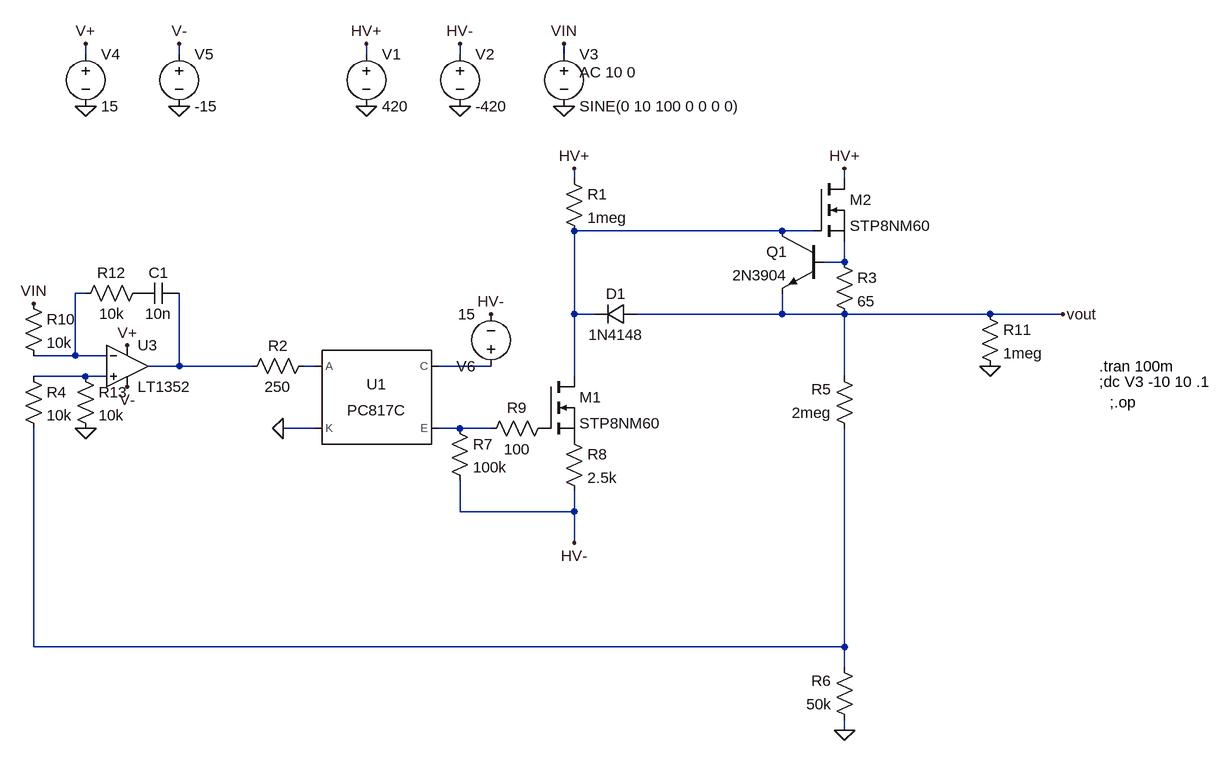
[diagram p0: schematic Draft11.asc]
Draft11.asc, the LTspice schematic file:
Version 4
SHEET 1 1216 932
WIRE -544 -208 -544 -224
WIRE -400 -208 -400 -224
WIRE -112 -208 -112 -224
WIRE 32 -208 32 -224
WIRE 192 -208 192 -224
WIRE 208 -16 208 -32
WIRE 624 -16 624 -32
WIRE 528 64 208 64
WIRE 576 64 528 64
WIRE 624 112 624 80
WIRE 624 112 592 112
WIRE -544 160 -560 160
WIRE 208 192 208 64
WIRE 240 192 208 192
WIRE 528 192 528 160
WIRE 528 192 304 192
WIRE 624 192 528 192
WIRE 848 192 624 192
WIRE 960 192 848 192
WIRE -560 256 -560 160
WIRE -560 256 -624 256
WIRE -512 256 -560 256
WIRE -400 272 -400 160
WIRE -400 272 -448 272
WIRE -288 272 -400 272
WIRE -192 272 -208 272
WIRE 80 272 0 272
WIRE -544 288 -624 288
WIRE -512 288 -544 288
WIRE 208 288 208 192
WIRE 624 288 624 192
WIRE -192 368 -240 368
WIRE 32 368 0 368
WIRE 80 368 32 368
WIRE 32 496 32 448
WIRE 208 496 208 464
WIRE 208 496 32 496
WIRE 208 544 208 496
WIRE -624 704 -624 368
WIRE 624 704 624 368
WIRE 624 704 -624 704
WIRE 624 736 624 704
WIRE 624 832 624 816
FLAG -112 -128 0
FLAG 32 -128 0
FLAG 192 -128 0
FLAG -112 -224 HV+
FLAG 32 -224 HV-
FLAG 192 -224 VIN
FLAG 208 -32 HV+
FLAG 624 -32 HV+
FLAG -544 -128 0
FLAG -400 -128 0
FLAG -544 -224 V+
FLAG -400 -224 V-
FLAG -480 240 V+
FLAG -480 304 V-
FLAG 960 192 vout
FLAG 624 832 0
FLAG -624 176 VIN
FLAG 208 544 HV-
FLAG 80 192 HV-
FLAG 848 272 0
FLAG -240 368 0
FLAG -544 368 0
SYMBOL voltage -112 -224 R0
WINDOW 123 0 0 Left 2
WINDOW 39 0 0 Left 2
SYMATTR InstName V1
SYMATTR Value 420
SYMBOL voltage 32 -224 R0
WINDOW 123 0 0 Left 2
WINDOW 39 0 0 Left 2
SYMATTR InstName V2
SYMATTR Value -420
SYMBOL voltage 192 -224 R0
WINDOW 123 24 44 Left 2
WINDOW 39 0 0 Left 2
SYMATTR Value2 AC 10 0
SYMATTR InstName V3
SYMATTR Value SINE(0 10 100 0 0 0 0)
SYMBOL nmos 576 -16 R0
SYMATTR InstName M2
SYMATTR Value STP8NM60
SYMBOL npn 592 64 M0
SYMATTR InstName Q1
SYMATTR Value 2N3904
SYMBOL res 608 96 R0
SYMATTR InstName R3
SYMATTR Value 65
SYMBOL voltage -544 -224 R0
WINDOW 123 0 0 Left 2
WINDOW 39 0 0 Left 2
SYMATTR InstName V4
SYMATTR Value 15
SYMBOL voltage -400 -224 R0
WINDOW 123 0 0 Left 2
WINDOW 39 0 0 Left 2
SYMATTR InstName V5
SYMATTR Value -15
SYMBOL res 640 384 R180
WINDOW 0 36 76 Left 2
WINDOW 3 36 40 Left 2
SYMATTR InstName R5
SYMATTR Value 2meg
SYMBOL res 640 832 R180
WINDOW 0 36 76 Left 2
WINDOW 3 36 40 Left 2
SYMATTR InstName R6
SYMATTR Value 50k
SYMBOL res 192 -32 R0
SYMATTR InstName R1
SYMATTR Value 1meg
SYMBOL res -640 272 R0
SYMATTR InstName R4
SYMATTR Value 10k
SYMBOL res -640 160 R0
SYMATTR InstName R10
SYMATTR Value 10k
SYMBOL Opamps\\LT1352 -480 208 R0
SYMATTR InstName U3
SYMBOL res 192 368 R0
SYMATTR InstName R8
SYMATTR Value 2.5k
SYMBOL nmos 160 288 R0
SYMATTR InstName M1
SYMATTR Value STP8NM60
SYMBOL res 176 352 R90
WINDOW 0 0 56 VBottom 2
WINDOW 3 32 56 VTop 2
SYMATTR InstName R9
SYMATTR Value 100
SYMBOL res -192 256 R90
WINDOW 0 0 56 VBottom 2
WINDOW 3 32 56 VTop 2
SYMATTR InstName R2
SYMATTR Value 250
SYMBOL voltage 80 288 R180
WINDOW 123 0 0 Left 2
WINDOW 39 0 0 Left 2
SYMATTR InstName V6
SYMATTR Value 15
SYMBOL res 16 352 R0
SYMATTR InstName R7
SYMATTR Value 100k
SYMBOL res 832 176 R0
SYMATTR InstName R11
SYMATTR Value 1meg
SYMBOL diode 304 176 R90
WINDOW 0 0 32 VBottom 2
WINDOW 3 32 32 VTop 2
SYMATTR InstName D1
SYMATTR Value 1N4148
SYMBOL Optos\\PC817C -96 320 R0
SYMATTR InstName U1
SYMBOL res -448 144 R90
WINDOW 0 0 56 VBottom 2
WINDOW 3 32 56 VTop 2
SYMATTR InstName R12
SYMATTR Value 10k
SYMBOL cap -400 144 R90
WINDOW 0 0 32 VBottom 2
WINDOW 3 32 32 VTop 2
SYMATTR InstName C1
SYMATTR Value 10n
SYMBOL res -560 272 R0
SYMATTR InstName R13
SYMATTR Value 10k
TEXT 1016 296 Left 2 !;dc V3 -10 10 .1
TEXT 1016 272 Left 2 !.tran 100m
TEXT 1032 328 Left 2 !;.op

The netlist it stands for:
* Draft11.asc
V1 HV+ 0 420
V2 HV- 0 -420
V3 VIN 0 SINE(0 10 100 0 0 0 0) AC 10 0
M2 HV+ N001 N002 N002 STP8NM60
Q1 N001 N002 vout 0 2N3904
R3 N002 vout 65
V4 V+ 0 15
V5 V- 0 -15
R5 N009 vout 2meg
R6 0 N009 50k
R1 HV+ N001 1meg
R4 N007 N009 10k
R10 VIN N003 10k
XU3 N007 N003 V+ V- N004 LT1352  ; pins In+ In- V+ V- OUT
R8 P001 HV- 2.5k
M1 N001 P002 P001 P001 STP8NM60
R9 P002 N008 100
R2 N005 N004 250
V6 N006 HV- 15
R7 N008 HV- 100k
R11 vout 0 1meg
D1 vout N001 1N4148
XU1 N005 0 N006 N008 PC817 Igain=2.3m  ; PC817C, pins A K C E
R12 P003 N003 10k
C1 N004 P003 10n
R13 N007 0 10k
.model D D
.lib standard.dio
.model NPN NPN
.model PNP PNP
.lib standard.bjt
.model NMOS NMOS
.model PMOS PMOS
.lib standard.mos
;dc V3 -10 10 .1
.tran 100m
;.op
.lib LTC.lib
.lib PC817.sub
.backanno
.end